# Altium project ARM_CTR.PrjPcb
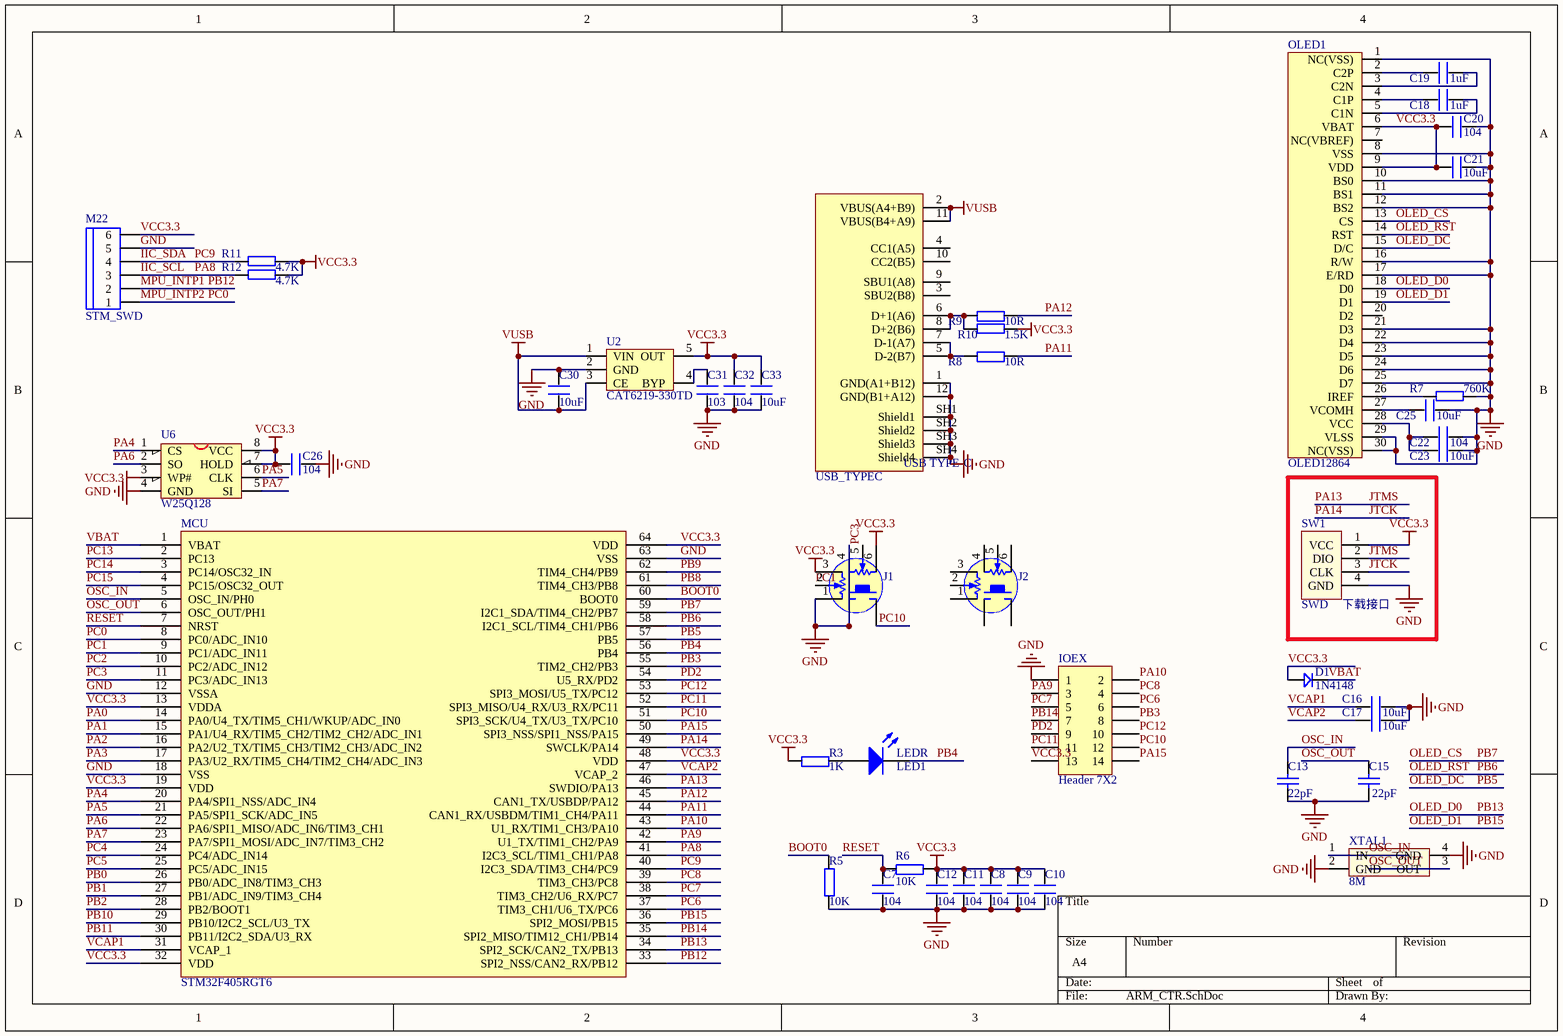
[diagram p0: ARM_CTR.SchDoc]
2 sheets, 87 parts. Net scope: global (net labels, ports and power ports of the same name join across sheets).
Board file: ARM_CTR.PcbDoc
Sheets:
  ARM_CTR.SchDoc
  ARM_CTR_STM_DRV.SchDoc

## Sheet ARM_CTR.SchDoc
size A4

### Parts
C7  104  [C 0603_L]
C8  104  [C 0603_L]
C9  104  [C 0603_L]
C10  104  [C 0603_L]
C11  104  [C 0603_L]
C12  104  [C 0603_L]
C13  22pF  [C 0603_L]
C15  22pF  [C 0603_L]
C16  10uF  [C 0603_L]
C17  10uF  [C 0603_L]
C18  1uF  [C 0603_L]
C19  1uF  [C 0603_L]
C20  104  [C 0603_L]
C21  10uF  [C 0603_L]
C22  104  [C 0603_L]
C23  10uF  [C 0603_L]
C25  10uF  [C 0603_L]
C26  104  [C 0603_L]
C30  10uF  [C 0603_L]
C31  103  [C 0603_L]
C32  104  [C 0603_L]
C33  10uF  [C 0603_L]
D1  1N4148  [SOD-323]
IOEX  Header 7X2  [HDR2.54-LI-2x7P]
J1  方向摇杆  [Joystick]  (value not drawn)
J2  方向摇杆  [Joystick]  (value not drawn)
LEDR  LED1  [LED 0805B]
M22  STM_SWD  [SH1.0-6P]
MCU  STM32F405RGT6  [LQFP64 10X10_L]
OLED1  OLED12864  [OLED_0.96]
R3  1K  [R 0603_L]
R5  10K  [R 0603_L]
R6  10K  [R 0603_L]
R7  760K  [R 0603_L]
R8  10R  [R 0603_L]
R9  10R  [R 0603_L]
R10  1.5K  [R 0603_L]
R11  4.7K  [R 0603_L]
R12  4.7K  [R 0603_L]
SW1  SWD  [HDR2.54-LI-4P]
U2  CAT6219-330TD  [SOT23-5L]
U6  W25Q128  [SOP8W_L]
USB_TYPEC  USB TypeC  [USB Type-C]  (value not drawn)
XTAL1  8M  [XTAL3225   无源]

### Blocks framed on the sheet
下载接口: SW1

### Nets
GND: C7.1 C8.1 C9.1 C10.1 C11.1 C12.1 C13.1 C15.1 C16.1 C17.1 C20.1 C21.1 C22.1 C23.1 C25.1 C26.2 C30.2 C31.1 C32.1 C33.1 IOEX.1 J1.1 J1.4 J1.J2 M22.5 MCU.12(VSSA) MCU.18(VSS) MCU.63(VSS) OLED1.1(NC(VSS)) OLED1.8(VSS) OLED1.10(BS0) OLED1.11(BS1) OLED1.12(BS2) OLED1.16(R/W) OLED1.17(E/RD) OLED1.21(D3) OLED1.22(D4) OLED1.23(D5) OLED1.24(D6) OLED1.25(D7) OLED1.29(VLSS) OLED1.30(NC(VSS)) R5.1 R7.1 SW1.4(GND) U2.2(GND) U6.4(GND) USB_TYPEC.1(GND(A1+B12)) USB_TYPEC.12(GND(B1+A12)) USB_TYPEC.SH1(Shield1) USB_TYPEC.SH2(Shield2) USB_TYPEC.SH3(Shield3) USB_TYPEC.SH4(Shield4) XTAL1.2(GND) XTAL1.4(GND)
VCC3.3: C8.2 C9.2 C10.2 C11.2 C12.2 C20.2 C21.2 C26.1 C32.2 C33.2 D1.1 IOEX.13 J1.3 J1.6 M22.6 MCU.13(VDDA) MCU.19(VDD) MCU.32(VDD) MCU.48(VDD) MCU.64(VDD) OLED1.6(VBAT) OLED1.9(VDD) R3.1 R6.2 R10.1 R11.1 R12.1 SW1.1(VCC) U2.5(OUT) U6.3(WP#) U6.7(HOLD) U6.8(VCC)
VUSB: C30.1 U2.1(VIN) U2.3(CE) USB_TYPEC.2(VBUS(A4+B9)) USB_TYPEC.11(VBUS(B4+A9))
BOOT0: MCU.60(BOOT0) R5.2
IIC_SCL: M22.3 MCU.41(I2C3_SCL/TIM1_CH1/PA8) R12.2  [also labelled PA8]
IIC_SDA: M22.4 MCU.40(I2C3_SDA/TIM3_CH4/PC9) R11.2  [also labelled PC9]
JTCK: MCU.49(SWCLK/PA14) SW1.3(CLK)  [also labelled PA14]
JTMS: MCU.46(SWDIO/PA13) SW1.2(DIO)  [also labelled PA13]
MPU_INTP1: M22.2 MCU.33(SPI2_NSS/CAN2_RX/PB12)  [also labelled PB12]
MPU_INTP2: M22.1 MCU.8(PC0/ADC_IN10)  [also labelled PC0]
OLED_CS: MCU.59(I2C1_SDA/TIM4_CH2/PB7) OLED1.13(CS)  [also labelled PB7]
OLED_D0: MCU.34(SPI2_SCK/CAN2_TX/PB13) OLED1.18(D0)  [also labelled PB13]
OLED_D1: MCU.36(SPI2_MOSI/PB15) OLED1.19(D1)  [also labelled PB15]
OLED_DC: MCU.57(PB5) OLED1.15(D/C)  [also labelled PB5]
OLED_RST: MCU.58(I2C1_SCL/TIM4_CH1/PB6) OLED1.14(RST)  [also labelled PB6]
OSC_IN: C13.2 MCU.5(OSC_IN/PH0) XTAL1.1(IN)
OSC_OUT: C15.2 MCU.6(OSC_OUT/PH1) XTAL1.3(OUT)
PA0: MCU.14(PA0/U4_TX/TIM5_CH1/WKUP/ADC_IN0)
PA1: MCU.15(PA1/U4_RX/TIM5_CH2/TIM2_CH2/ADC_IN1)  [project net INDEX2]
PA2: MCU.16(PA2/U2_TX/TIM5_CH3/TIM2_CH3/ADC_IN2)  [project net MS4]
PA3: MCU.17(PA3/U2_RX/TIM5_CH4/TIM2_CH4/ADC_IN3)  [project net MS3]
PA4: MCU.20(PA4/SPI1_NSS/ADC_IN4) U6.1(CS)
PA5: MCU.21(PA5/SPI1_SCK/ADC_IN5) U6.6(CLK)
PA6: MCU.22(PA6/SPI1_MISO/ADC_IN6/TIM3_CH1) U6.2(SO)
PA7: MCU.23(PA7/SPI1_MOSI/ADC_IN7/TIM3_CH2) U6.5(SI)
PA9: IOEX.3 MCU.42(U1_TX/TIM1_CH2/PA9)
PA10: IOEX.2 MCU.43(U1_RX/TIM1_CH3/PA10)
PA11: MCU.44(CAN1_RX/USBDM/TIM1_CH4/PA11) R8.2
PA12: MCU.45(CAN1_TX/USBDP/PA12) R9.2
PA15: IOEX.14 MCU.50(SPI3_NSS/SPI1_NSS/PA15)
PB0: MCU.26(PB0/ADC_IN8/TIM3_CH3)  [project net DIR1]
PB1: MCU.27(PB1/ADC_IN9/TIM3_CH4)
PB2: MCU.28(PB2/BOOT1)  [project net MS2]
PB3: IOEX.8 MCU.55(TIM2_CH2/PB3)
PB4: LEDR.2(K) MCU.56(PB4)
PB8: MCU.61(TIM4_CH3/PB8)  [project net DIR3]
PB9: MCU.62(TIM4_CH4/PB9)
PB10: MCU.29(PB10/I2C2_SCL/U3_TX)
PB11: MCU.30(PB11/I2C2_SDA/U3_RX)  [project net MS1]
PB14: IOEX.7 MCU.35(SPI2_MISO/TIM12_CH1/PB14)
PC1: J1.2 MCU.9(PC1/ADC_IN11)
PC2: MCU.10(PC2/ADC_IN12)  [project net DIR2]
PC3: J1.5 MCU.11(PC3/ADC_IN13)
PC4: MCU.24(PC4/ADC_IN14)  [project net ENN1]
PC5: MCU.25(PC5/ADC_IN15)  [project net INDEX1]
PC6: IOEX.6 MCU.37(TIM3_CH1/U6_TX/PC6)
PC7: IOEX.5 MCU.38(TIM3_CH2/U6_RX/PC7)
PC8: IOEX.4 MCU.39(TIM3_CH3/PC8)
PC10: IOEX.12 J1.J1 MCU.51(SPI3_SCK/U4_TX/U3_TX/PC10)
PC11: IOEX.11 MCU.52(SPI3_MISO/U4_RX/U3_RX/PC11)
PC12: IOEX.10 MCU.53(SPI3_MOSI/U5_TX/PC12)
PC13: MCU.2(PC13)  [project net INDEX3]
PC14: MCU.3(PC14/OSC32_IN)  [project net MS6]
PC15: MCU.4(PC15/OSC32_OUT)  [project net MS5]
PD2: IOEX.9 MCU.54(U5_RX/PD2)
RESET: C7.2 MCU.7(NRST) R6.1
VBAT: D1.2 MCU.1(VBAT)
VCAP1: C16.2 MCU.31(VCAP_1)
VCAP2: C17.2 MCU.47(VCAP_2)
NetC18_1: C18.1 OLED1.5(C1N)
NetC18_2: C18.2 OLED1.4(C1P)
NetC19_1: C19.1 OLED1.3(C2N)
NetC19_2: C19.2 OLED1.2(C2P)
NetC22_2: C22.2 C23.2 OLED1.28(VCC)
NetC25_2: C25.2 OLED1.27(VCOMH)
NetC31_2: C31.2 U2.4(BYP)
NetLEDR_1: LEDR.1(A) R3.2
NetOLED1_26: OLED1.26(IREF) R7.2
NetR8_1: R8.1 USB_TYPEC.5(D-2(B7)) USB_TYPEC.7(D-1(A7))
NetR9_1: R9.1 R10.2 USB_TYPEC.6(D+1(A6)) USB_TYPEC.8(D+2(B6))

Not connected (* = marked no-connect by the designer): J2 1 2 3 4 5 6 J1 J2; OLED1 7(NC(VBREF)) 20(D2); USB_TYPEC 3(SBU2(B8)) 4(CC1(A5)) 9(SBU1(A8)) 10(CC2(B5))

### Notes on the sheet
- (in symbol USB Type-C) USB TYPE-C

### Library data of the parts
C7-C12 C16-C23 C25 C26 C30-C33 = C
C13 C15 = CAP
D1 = D
IOEX = Header 7X2: Header, 7-Pin, Dual row; LatestRevisionDate: 17-Jul-2002; LatestRevisionNote: Re-released for DXP Platform.; Publisher: Altium Limited
J1 J2 = 摇杆_1: 摇杆
LEDR = LED2: Typical RED, GREEN, YELLOW, AMBER GaAs LED; Published: 8-Jun-2000; LatestRevisionDate: 17-Jul-2002; LatestRevisionNote: Re-released for DXP Platform.; PackageDocument: Feb-2002; PackageReference: 3.2X1.6X1.1; Publisher: Altium Limited
M22 = HEAD6
MCU = STM32F405RGT6: Flaah:256/RAM:48/IO:51
R3 R5-R12 = R
U2 = CAT6219-330TD: 3.3V 500mA LDO
U6 = W25X16: W25X16;SST25VF016;MX25L1605
USB_TYPEC = USB Type-C: 12P TypeC 母座
XTAL1 = XTAL-无源贴片: 无源贴片晶振

## Sheet ARM_CTR_STM_DRV.SchDoc
size A4
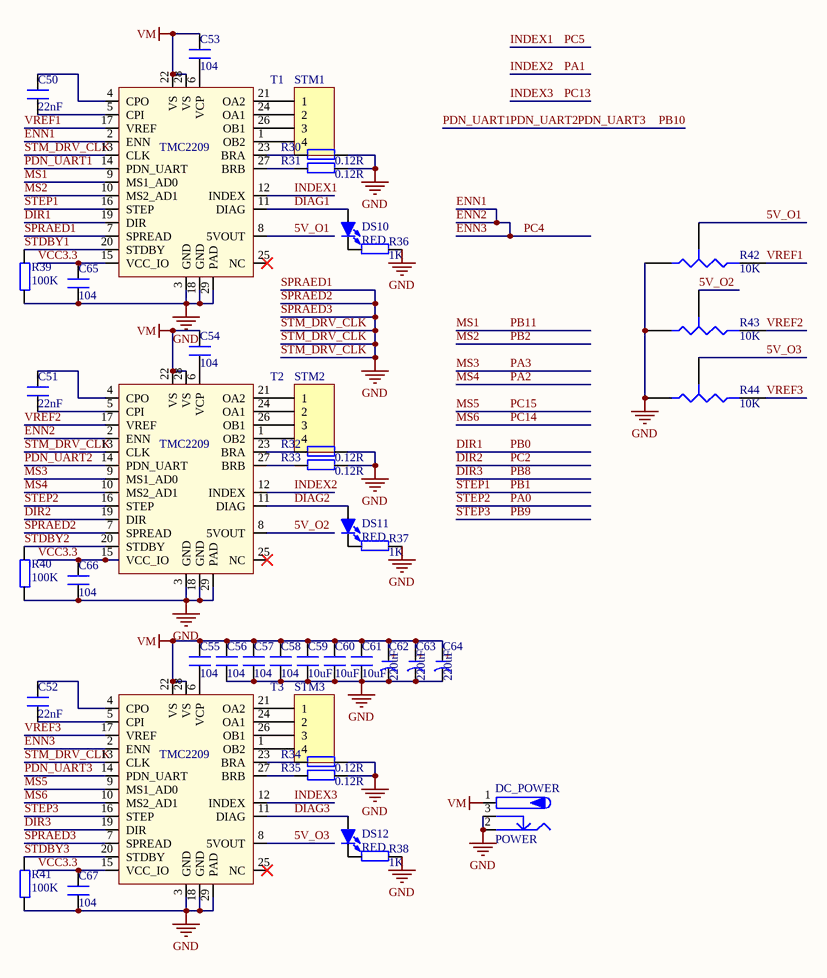
[diagram p1: ARM_CTR_STM_DRV.SchDoc]

### Parts
C50  22nF  [C 0603_L]
C51  22nF  [C 0603_L]
C52  22nF  [C 0603_L]
C53  104  [C 0603_L]
C54  104  [C 0603_L]
C55  104  [C 0603_L]
C56  104  [C 0603_L]
C57  104  [C 0603_L]
C58  104  [C 0603_L]
C59  10uF  [C 0603_L]
C60  10uF  [C 0603_L]
C61  10uF  [C 0603_L]
C62  220uF  [CM D(6.3*5.4)]
C63  220uF  [CM D(6.3*5.4)]
C64  220uF  [CM D(6.3*5.4)]
C65  104  [C 0603_L]
C66  104  [C 0603_L]
C67  104  [C 0603_L]
DC_POWER  POWER  [DC10B]
DS10  RED  [LED 0805R]
DS11  RED  [LED 0805R]
DS12  RED  [LED 0805R]
R30  0.12R  [R 0805_L]
R31  0.12R  [R 0805_L]
R32  0.12R  [R 0805_L]
R33  0.12R  [R 0805_L]
R34  0.12R  [R 0805_L]
R35  0.12R  [R 0805_L]
R36  1K  [R 0603_L]
R37  1K  [R 0603_L]
R38  1K  [R 0603_L]
R39  100K  [R 0603_L]
R40  100K  [R 0603_L]
R41  100K  [R 0603_L]
R42  value 10K  [3362P]  (hidden comment: Res Tap)
R43  value 10K  [3362P]  (hidden comment: Res Tap)
R44  value 10K  [3362P]  (hidden comment: Res Tap)
STM1  Header 4  [XH2.54-WI-4P]  (value not drawn)
STM2  Header 4  [XH2.54-WI-4P]  (value not drawn)
STM3  Header 4  [XH2.54-WI-4P]  (value not drawn)
T1  TMC2209  [QFN28 5x5_L]
T2  TMC2209  [QFN28 5x5_L]
T3  TMC2209  [QFN28 5x5_L]

### Nets
GND: C56.1 C57.1 C58.1 C59.1 C60.1 C61.1 C62.2(K) C63.2(K) C64.2(K) C65.1 C66.1 C67.1 DC_POWER.2 DC_POWER.3 R30.1 R31.1 R32.1 R33.1 R34.1 R35.1 R36.1 R37.1 R38.1 R39.1 R40.1 R41.1 R42.1(A) R43.1(A) R44.1(A) T1.3(GND) T1.7(SPREAD) T1.13(CLK) T1.18(GND) T1.29(PAD) T2.3(GND) T2.7(SPREAD) T2.13(CLK) T2.18(GND) T2.29(PAD) T3.3(GND) T3.7(SPREAD) T3.13(CLK) T3.18(GND) T3.29(PAD)  [also labelled SPRAED1, SPRAED2, SPRAED3, STM_DRV_CLK]
VCC3.3: C65.2 C66.2 C67.2 T1.15(VCC_IO) T2.15(VCC_IO) T3.15(VCC_IO)
VM: C53.2 C54.2 C55.2 C56.2 C57.2 C58.2 C59.2 C60.2 C61.2 C62.1(A) C63.1(A) C64.1(A) DC_POWER.1 T1.22(VS) T1.28(VS) T2.22(VS) T2.28(VS) T3.22(VS) T3.28(VS)
5V_O1: R42.3(TAP) T1.8(5VOUT)
5V_O2: R43.3(TAP) T2.8(5VOUT)
5V_O3: R44.3(TAP) T3.8(5VOUT)
DIAG1: DS10.1(A) T1.11(DIAG)
DIAG2: DS11.1(A) T2.11(DIAG)
DIAG3: DS12.1(A) T3.11(DIAG)
DIR1: T1.19(DIR)  [also labelled PB0]
DIR2: T2.19(DIR)  [also labelled PC2]
DIR3: T3.19(DIR)  [also labelled PB8]
ENN1: T1.2(ENN) T2.2(ENN) T3.2(ENN)  [also labelled ENN2, ENN3, PC4]
INDEX1: T1.12(INDEX)  [also labelled PC5]
INDEX2: T2.12(INDEX)  [also labelled PA1]
INDEX3: T3.12(INDEX)  [also labelled PC13]
MS1: T1.9(MS1_AD0)  [also labelled PB11]
MS2: T1.10(MS2_AD1)  [also labelled PB2]
MS3: T2.9(MS1_AD0)  [also labelled PA3]
MS4: T2.10(MS2_AD1)  [also labelled PA2]
MS5: T3.9(MS1_AD0)  [also labelled PC15]
MS6: T3.10(MS2_AD1)  [also labelled PC14]
PA0: T2.16(STEP)  [also labelled STEP2]
PB1: T1.16(STEP)  [also labelled STEP1]
PB9: T3.16(STEP)  [also labelled STEP3]
PB10: T1.14(PDN_UART) T2.14(PDN_UART) T3.14(PDN_UART)  [also labelled PDN_UART1, PDN_UART2, PDN_UART3]
STDBY1: R39.2 T1.20(STDBY)
STDBY2: R40.2 T2.20(STDBY)
STDBY3: R41.2 T3.20(STDBY)
VREF1: R42.2(B) T1.17(VREF)
VREF2: R43.2(B) T2.17(VREF)
VREF3: R44.2(B) T3.17(VREF)
NetC50_1: C50.1 T1.5(CPI)
NetC50_2: C50.2 T1.4(CPO)
NetC51_1: C51.1 T2.5(CPI)
NetC51_2: C51.2 T2.4(CPO)
NetC52_1: C52.1 T3.5(CPI)
NetC52_2: C52.2 T3.4(CPO)
NetC53_1: C53.1 T1.6(VCP)
NetC54_1: C54.1 T2.6(VCP)
NetC55_1: C55.1 T3.6(VCP)
NetDS10_2: DS10.2(K) R36.2
NetDS11_2: DS11.2(K) R37.2
NetDS12_2: DS12.2(K) R38.2
NetR30_2: R30.2 T1.23(BRA)
NetR31_2: R31.2 T1.27(BRB)
NetR32_2: R32.2 T2.23(BRA)
NetR33_2: R33.2 T2.27(BRB)
NetR34_2: R34.2 T3.23(BRA)
NetR35_2: R35.2 T3.27(BRB)
NetSTM1_1: STM1.1 T1.21(OA2)
NetSTM1_2: STM1.2 T1.24(OA1)
NetSTM1_3: STM1.3 T1.26(OB1)
NetSTM1_4: STM1.4 T1.1(OB2)
NetSTM2_1: STM2.1 T2.21(OA2)
NetSTM2_2: STM2.2 T2.24(OA1)
NetSTM2_3: STM2.3 T2.26(OB1)
NetSTM2_4: STM2.4 T2.1(OB2)
NetSTM3_1: STM3.1 T3.21(OA2)
NetSTM3_2: STM3.2 T3.24(OA1)
NetSTM3_3: STM3.3 T3.26(OB1)
NetSTM3_4: STM3.4 T3.1(OB2)

Not connected (* = marked no-connect by the designer): T1 25(NC)*; T2 25(NC)*; T3 25(NC)*

### Notes on the sheet
- (in symbol C-CM) +

### Library data of the parts
C50-C61 C65-C67 = C
C62-C64 = C-CM: 贴片电解电容; 版权归属: 源创客; BOM名称: 贴片电解电容; 学习资源: www.ooocke.com
DC_POWER = P-DC: 低压电源接口; BOM名称: DC电源接口; 版权归属: 源创客; 学习资源: www.ooocke.com
DS10-DS12 = LED-SMD: 贴片LED; 版权归属: 源创客; BOM名称: 贴片LED; 学习资源: www.ooocke.com
R30-R41 = R
R42-R44 = Res Tap: Tapped Resistor; Sim Note: Enter the Resistance value and the set point into parameter fields.; Set Position: 0.5; Published: 24-Mar-1999; LatestRevisionDate: 17-Jul-2002; LatestRevisionNote: Re-released for DXP Platform.; PackageReference: VR3; Publisher: Altium Limited; PackageDescription: Variable Resistor, Thru-Hole; 3 Leads
STM1-STM3 = Header 4: Header, 4-Pin; LatestRevisionDate: 17-Jul-2002; LatestRevisionNote: Re-released for DXP Platform.; Publisher: Altium Limited
T1-T3 = TMC2209: 步进电机驱动芯片

## Nets that join several sheets
GND: ARM_CTR (55 pins), ARM_CTR_STM_DRV (44 pins)
VCC3.3: ARM_CTR (32 pins), ARM_CTR_STM_DRV (6 pins)
DIR1: ARM_CTR (MCU.26), ARM_CTR_STM_DRV (T1.19)
DIR2: ARM_CTR (MCU.10), ARM_CTR_STM_DRV (T2.19)
DIR3: ARM_CTR (MCU.61), ARM_CTR_STM_DRV (T3.19)
ENN1: ARM_CTR (MCU.24), ARM_CTR_STM_DRV (T1.2 T2.2 T3.2)
INDEX1: ARM_CTR (MCU.25), ARM_CTR_STM_DRV (T1.12)
INDEX2: ARM_CTR (MCU.15), ARM_CTR_STM_DRV (T2.12)
INDEX3: ARM_CTR (MCU.2), ARM_CTR_STM_DRV (T3.12)
MS1: ARM_CTR (MCU.30), ARM_CTR_STM_DRV (T1.9)
MS2: ARM_CTR (MCU.28), ARM_CTR_STM_DRV (T1.10)
MS3: ARM_CTR (MCU.17), ARM_CTR_STM_DRV (T2.9)
MS4: ARM_CTR (MCU.16), ARM_CTR_STM_DRV (T2.10)
MS5: ARM_CTR (MCU.4), ARM_CTR_STM_DRV (T3.9)
MS6: ARM_CTR (MCU.3), ARM_CTR_STM_DRV (T3.10)
PA0: ARM_CTR (MCU.14), ARM_CTR_STM_DRV (T2.16)
PB1: ARM_CTR (MCU.27), ARM_CTR_STM_DRV (T1.16)
PB9: ARM_CTR (MCU.62), ARM_CTR_STM_DRV (T3.16)
PB10: ARM_CTR (MCU.29), ARM_CTR_STM_DRV (T1.14 T2.14 T3.14)